# Altium project MTCH9010_Evaluation_Kit.PrjPcb
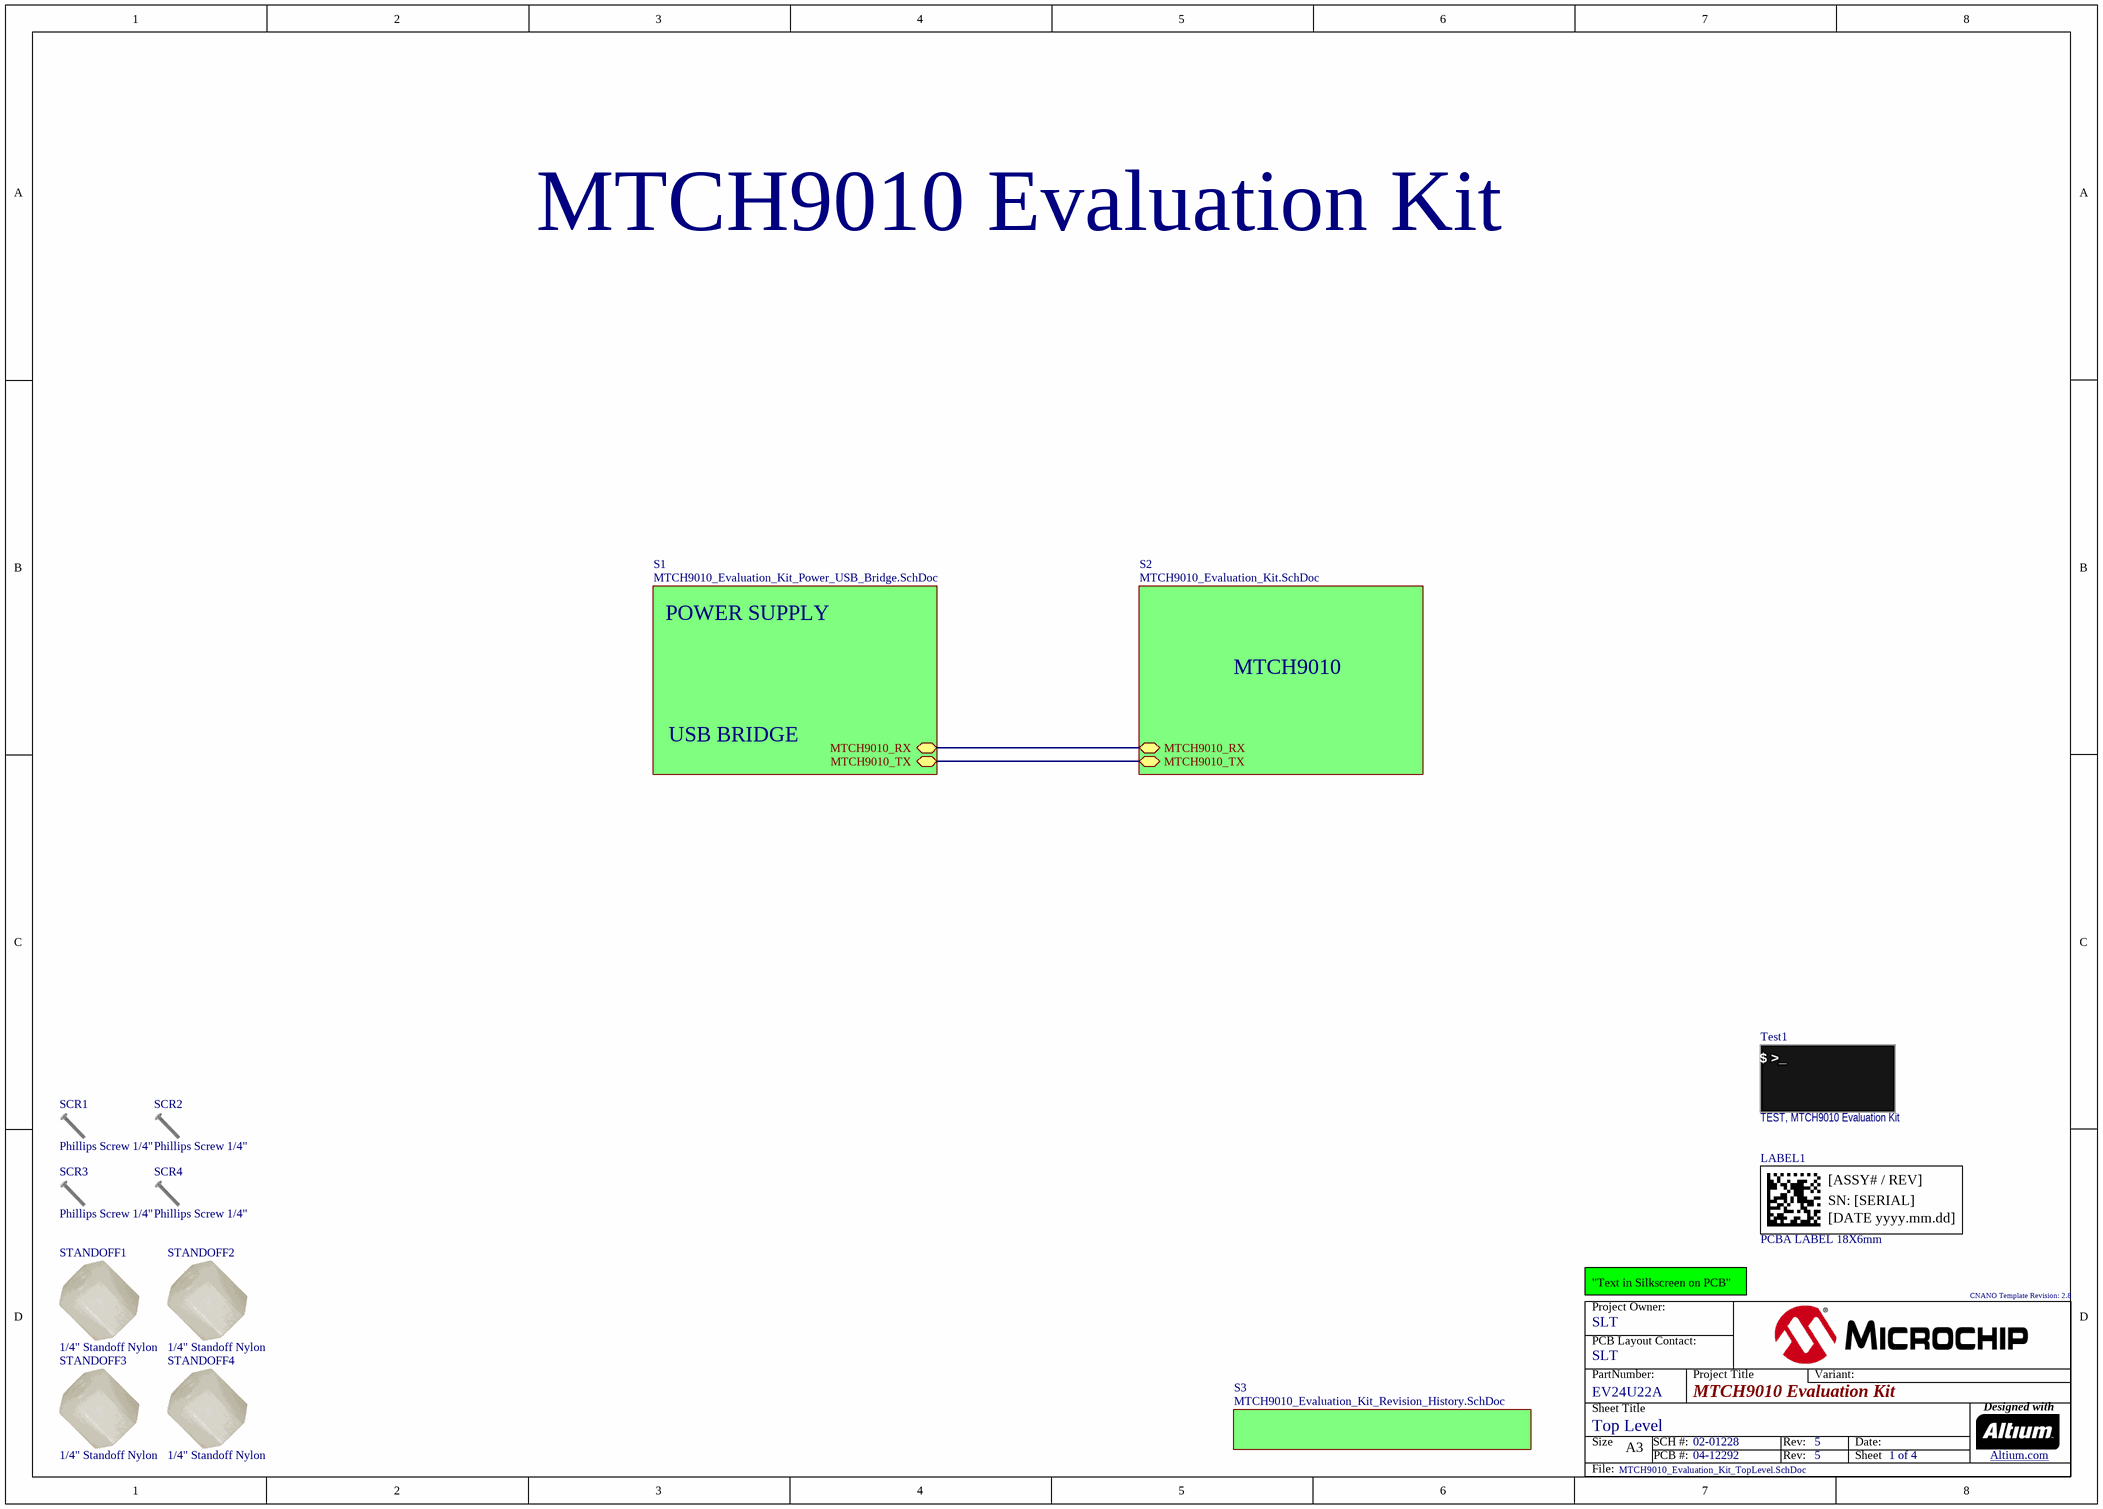
[diagram p0: MTCH9010_Evaluation_Kit_TopLevel.SchDoc]
ProjectTitle: MTCH9010 Evaluation Kit; ProjectTargetName: MTCH9010; ProjectPCBFabRevision: 5; ProjectPCBFabNumber: 04-12292; ProjectPCBAssyRevision: 5; ProjectPCBAssyNumber: 02-01228; ProjectPartNumber: EV24U22A; ProjectContactPCB: SLT; ProjectContactOwner: SLT; OutjobTitle: MTCH9010-Evaluation-Kit; CNANO_Template_Revision: 2.8
1 sheet, 10 parts. Net scope: hierarchical (ports join the sheet entries above them; power ports are global).
Board file: MTCH9010_Evaluation_Kit.PcbDoc

## Sheet MTCH9010_Evaluation_Kit_TopLevel.SchDoc
size A3; SheetTitle: Top Level; CompanyName: Microchip Technology Inc.; Organization: Microchip Technology; Address1: 2355 West Chandler Blvd.; Address2: Chandler, AZ  85224; Address4: USA; SheetNumber: 1; SheetTotal: 4; Time: Time

### Parts
LABEL1  value PCBA LABEL 18X6mm  [08-10015]  (hidden comment: 08-10015)
SCR1  value Phillips Screw 1/4"  (hidden comment: SCREW MACHINE)  (mechanical)
SCR2  value Phillips Screw 1/4"  (hidden comment: SCREW MACHINE)  (mechanical)
SCR3  value Phillips Screw 1/4"  (hidden comment: SCREW MACHINE)  (mechanical)
SCR4  value Phillips Screw 1/4"  (hidden comment: SCREW MACHINE)  (mechanical)
STANDOFF1  value 1/4" Standoff Nylon  [Standoff 0.25in]  (hidden comment: Standoff Nylon F-F)  (mechanical)
STANDOFF2  value 1/4" Standoff Nylon  [Standoff 0.25in]  (hidden comment: Standoff Nylon F-F)  (mechanical)
STANDOFF3  value 1/4" Standoff Nylon  [Standoff 0.25in]  (hidden comment: Standoff Nylon F-F)  (mechanical)
STANDOFF4  value 1/4" Standoff Nylon  [Standoff 0.25in]  (hidden comment: Standoff Nylon F-F)  (mechanical)
Test1  Description_: TEST, MTCH9010 Evaluation Kit  (hidden comment: Mechanical)  (mechanical)

### Sub-sheets
S1 = MTCH9010_Evaluation_Kit_Power_USB_Bridge.SchDoc (file not in this document): MTCH9010_TX (bidir), MTCH9010_RX (bidir)
S2 = MTCH9010_Evaluation_Kit.SchDoc (file not in this document): MTCH9010_RX (bidir), MTCH9010_TX (bidir)
S3 = MTCH9010_Evaluation_Kit_Revision_History.SchDoc (file not in this document): no entries

### Nets
(unnamed): sheet S2/MTCH9010_RX, sheet S1/MTCH9010_RX
(unnamed): sheet S2/MTCH9010_TX, sheet S1/MTCH9010_TX

### Notes on the sheet
- POWER SUPPLY
- USB BRIDGE
- "Text in Silkscreen on PCB"
- Project Owner:
- PCB Layout Contact:
- PartNumber:
- Project Title
- Variant:
- Sheet Title
- Size
- A3
- SCH #:
- PCB #:
- Rev:
- Date:
- Sheet
- Designed with
- Altium.com <http://go.altium.com/MicrochipLandingPage_Evaluation.html>
- File:
- (in symbol 08-10015) [ASSY# / REV]; SN: [SERIAL]; [DATE yyyy.mm.dd]
- (in symbol 13-01170) $ >_

### Library data of the parts
LABEL1 = 08-10015: Manufacturer 1: ACT Logimark AS; Manufacturer Part Number 1: 505462; Description_: LABEL PCBA 18x6mm Datamatrix Assy# / Rev / Serial / Date; Populated: MECH; MCHP-ID: 08-10015; Revision: 4; Symbol: 08-10015; Category: MCHP-Manufacturing; Type: PCBA Label; Manufacturer 2: Sunrise Paper (M) Sdn Bhd; Manufacturer Part Number 2: 037268-5; Manufacturer 3: Raynen; Manufacturer Part Number 3: 10010407; Supplier 1: ACT Logimark AS; Supplier Part Number 1: 505462; Supplier 2: Microchip Technology; Supplier Part Number 2: 01000-004967; Supplier 3: Raynen; Supplier Part Number 3: 10010407
SCR1-SCR4 = HW1011: Manufacturer 1: Keystone Electronics; Manufacturer Part Number 1: 9900; MCHP-ID: HW1011; Description_: MACHINE SCREW PAN PHILLIPS 4-40; Populated: YES; Revision: 1; Symbol: Screw machine; Type: Screw; Category: Hardware; Supplier 1: Digi-Key; Supplier Part Number 1: 36-9900-ND
STANDOFF1-STANDOFF4 = MECH0110: Manufacturer 1: Essentra Components; Manufacturer Part Number 1: 14HTSP001; Description_: MECH HW STAND-OFF #4-40 x 1/4" F/F HEX NYLON; Populated: YES; MCHP-ID: MECH0110; Revision: 2; Symbol: Standoff Nylon F-F; Type: Stand-off; Category: Hardware; Supplier 1: Digi-Key; Supplier Part Number 1: 145-14HTSP001-ND; Manufacturer 2: Keystone Electronics; Manufacturer Part Number 2: 1902A; Supplier 2: Digi-Key; Supplier Part Number 2: 36-1902A-ND
Test1 = 13-01170: Populated: Yes; MCHP-ID: 13-01170; Revision: 4; Category: MCHP-Manufacturing

## Assembly variants
Default Assembly: not fitted R116 R119